# Altium schematic sheet UI.SchDoc
size A4; SheetNumber: 3; SheetTotal: 4
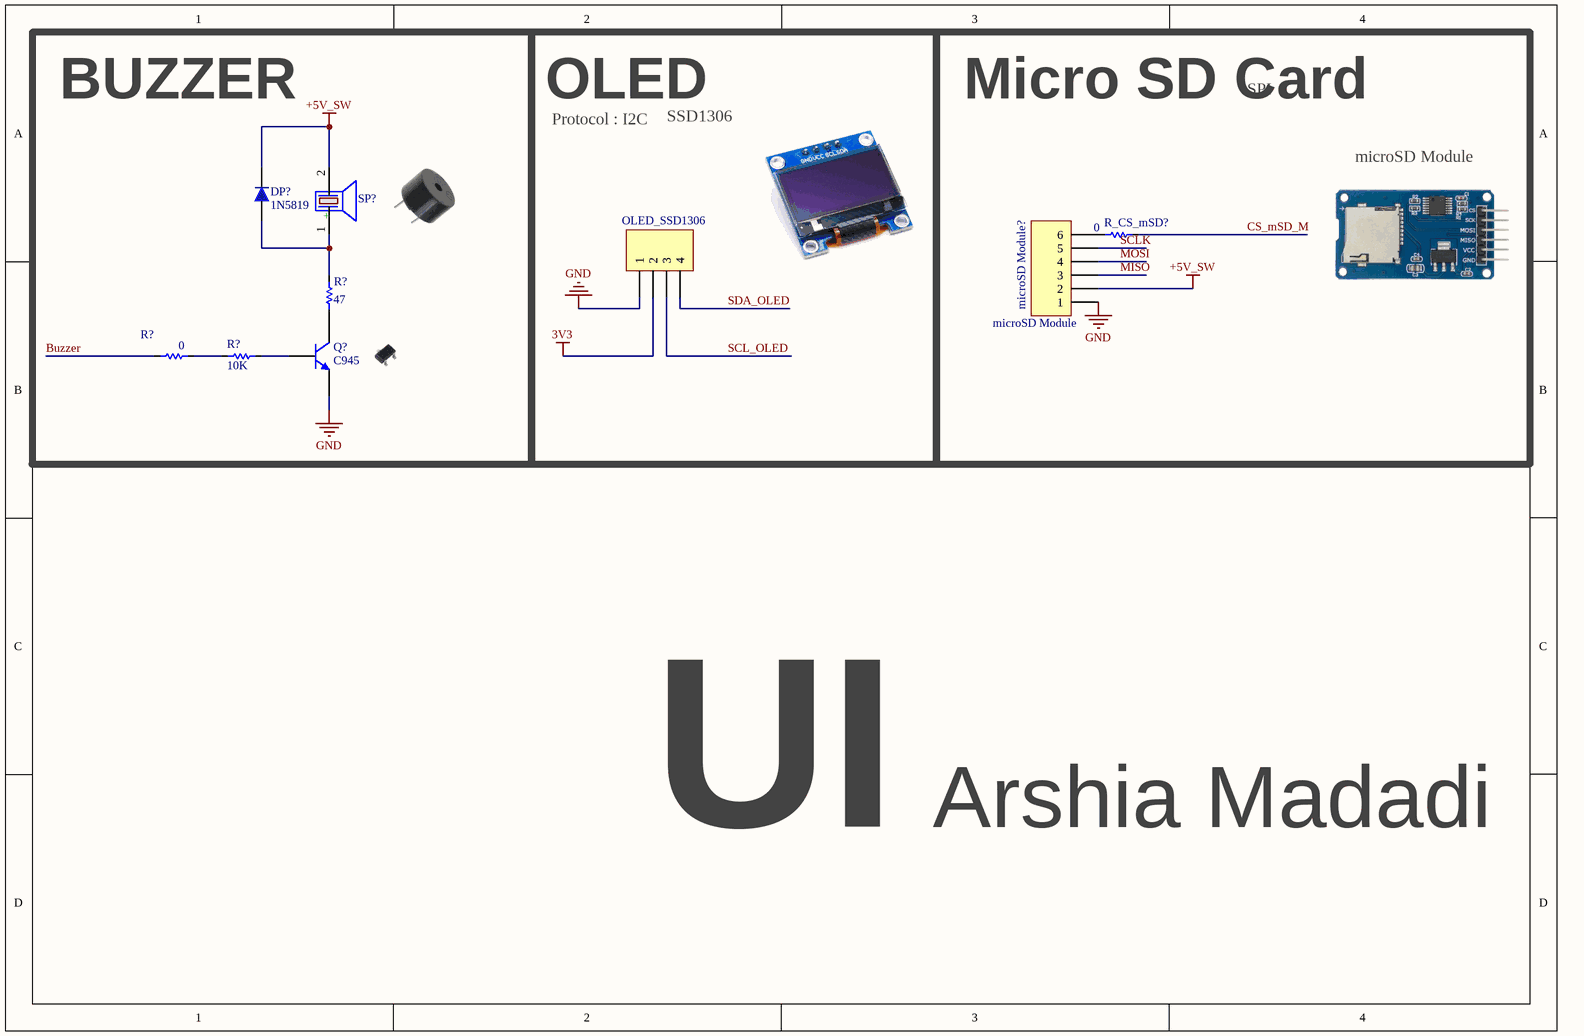
[diagram p0: UI.SchDoc]

## Parts
(Parts that share a designator on the sheet are numbered #1, #2 ... from top to bottom, then left to right.)
DP?  1N5819  [430X270D]
microSD_Module?  microSD Module  [HDR1X6-1]
OLED_SSD1306  Header 4  [My_1X04]  (value not drawn)
Q?  C945  [SOT23_M]
R?#1  47  [0603]
R?#2  0  [0603]
R?#3  10K  [0603]
R_CS_mSD?  0  [0603]
SP?  (no value)  [BUZZER 7.62mm DC]

## Blocks framed on the sheet
BUZZER: DP? Q? R?#1-R?#3 SP?
OLED: OLED_SSD1306
Micro SD Card: microSD_Module? R_CS_mSD?

## Nets
3V3: OLED_SSD1306.2
+5V_SW: DP?.2 microSD_Module?.2 SP?.2(-)
GND: microSD_Module?.1 OLED_SSD1306.1 Q?.2(E)
Buzzer: R?#2.2
CS_mSD_M: R_CS_mSD?.1
MISO: microSD_Module?.3
MOSI: microSD_Module?.4
SCL_OLED: OLED_SSD1306.3
SCLK: microSD_Module?.5
SDA_OLED: OLED_SSD1306.4
NetDP?_1: DP?.1 R?#1.2 SP?.1(+)
NetmicroSD_Module?_6: microSD_Module?.6 R_CS_mSD?.2
NetQ?_1: Q?.1(B) R?#3.1
NetQ?_3: Q?.3(C) R?#1.1
NetR?#2_1: R?#2.1 R?#3.2

## Notes on the sheet
- SPI
- Protocol : I2C
- SSD1306
- microSD Module
- Arshia Madadi
- UI

## Library data of the parts
DP? = 1N5819: Schottkey Rectifiers; Designer: Abbas Basereh; Data: 16-12-2016; Link: *; Part. No: *
microSD_Module? = Header 6: Header, 6-Pin; LatestRevisionDate: 17-Jul-2002; LatestRevisionNote: Re-released for DXP Platform.; Publisher: Altium Limited
OLED_SSD1306 = Header 4: Header, 4-Pin; LatestRevisionDate: 17-Jul-2002; LatestRevisionNote: Re-released for DXP Platform.; Publisher: Altium Limited
Q? = C945: NPN Silicon Epitaxial Planar Transistor; Published: 2017-2-8; LatestRevisionDate: 2017; LatestRevisionNote: IPC-7351 Footprint Added.; DatasheetVersion: 2017; PackageVersion: 2017-2-8; PackageReference: SOT23; Publisher: Abbas Basereh; PackageDescription: 3-Pin SOT-23 Package 0.95 mm Pitch, 2.3 mm Lead Span; ComponentLink1Description: Manufacturer Link; ComponentLink1URL: http://www.taitroncomponents.com/; ComponentLink2Description: Datasheet; ComponentLink2URL: http://www.taitroncomponents.com/
R?#1-R?#3 R_CS_mSD? = Res: Resistor; Published: 8-Jun-2000; LatestRevisionDate: 17-Jul-2002; LatestRevisionNote: Re-released for DXP Platform.; PackageReference: AXIAL-0.3; Publisher: Altium Limited
SP? = PIEZO BUZZER: PIEZO BUZZER ACTIVE; Designer: Abbas Basereh; Comment_1: SPEAKER AND BEEP; Design Date: 1395/11/14; ComponentLink2Description: Reference; PackageDescription: THD; Publisher: Abbas Basereh; Mounting Technology: THD; Pin Count: 2; Status: Unreleased